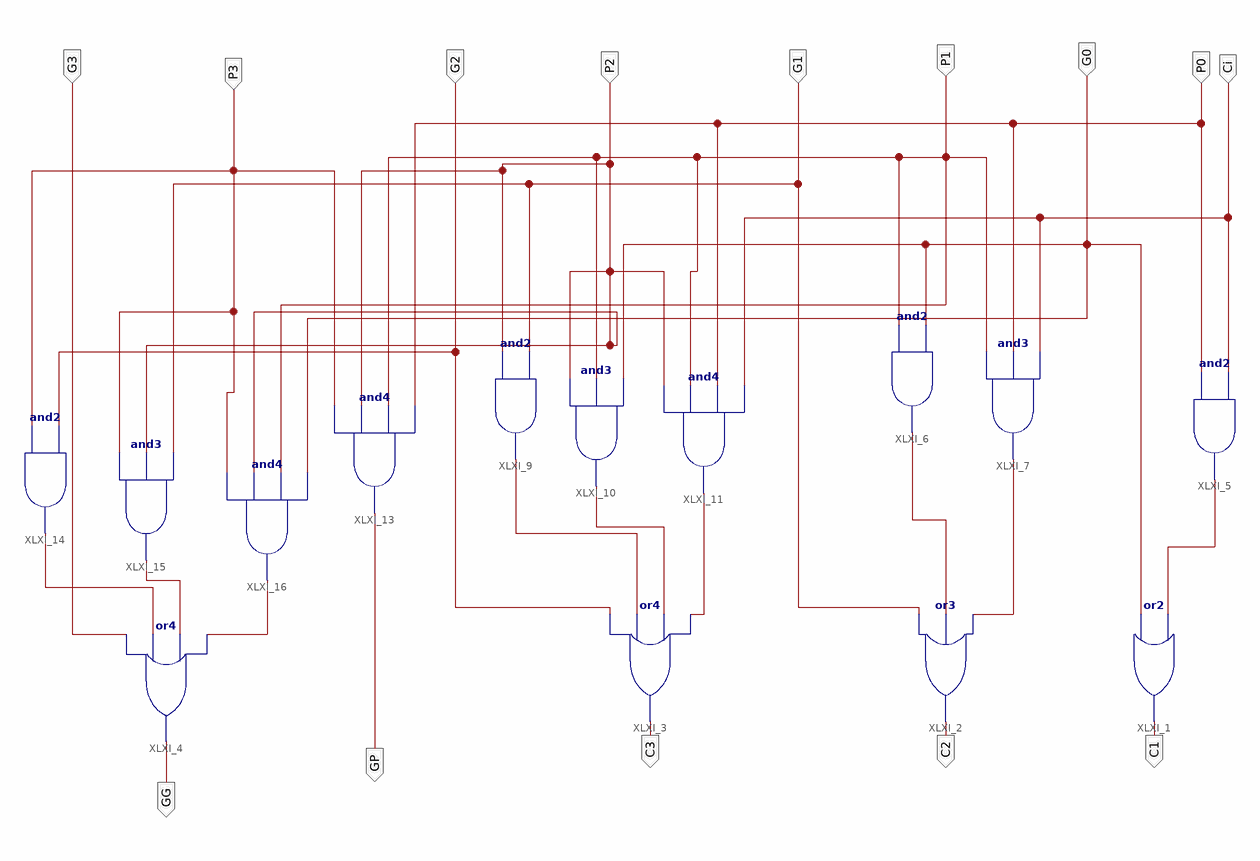
[diagram p0: schematic sheet 1]
// Xilinx ISE schematic CLA.sch (kintex7) as structural Verilog: 14 symbols, 14 ports
module CLA (
  input  Ci,
  input  G1,
  input  P3,
  input  G3,
  input  P1,
  input  G2,
  input  P2,
  input  G0,
  input  P0,
  output C1,
  output C2,
  output GG,
  output C3,
  output GP
);

  wire XLXN_12, XLXN_17, XLXN_19, XLXN_29, XLXN_30, XLXN_41, XLXN_52, XLXN_54, XLXN_55;

  or XLXI_1 (C1, G0, XLXN_12);
  or XLXI_2 (C2, G1, XLXN_17, XLXN_19);
  or XLXI_4 (GG, G3, XLXN_52, XLXN_54, XLXN_55);
  and XLXI_5 (XLXN_12, P0, Ci);
  and XLXI_6 (XLXN_17, P1, G0);
  and XLXI_7 (XLXN_19, P1, P0, Ci);
  or XLXI_3 (C3, G2, XLXN_29, XLXN_30, XLXN_41);
  and XLXI_10 (XLXN_30, P2, P1, G0);
  and XLXI_11 (XLXN_41, P2, P1, P0, Ci);
  and XLXI_9 (XLXN_29, P2, G1);
  and XLXI_13 (GP, P3, P2, P1, P0);
  and XLXI_14 (XLXN_52, P3, G2);
  and XLXI_15 (XLXN_54, P3, P2, G1);
  and XLXI_16 (XLXN_55, P3, P2, P1, G0);
endmodule
